# EAGLE design MiniAmp-01 (EAGLE 4.15)
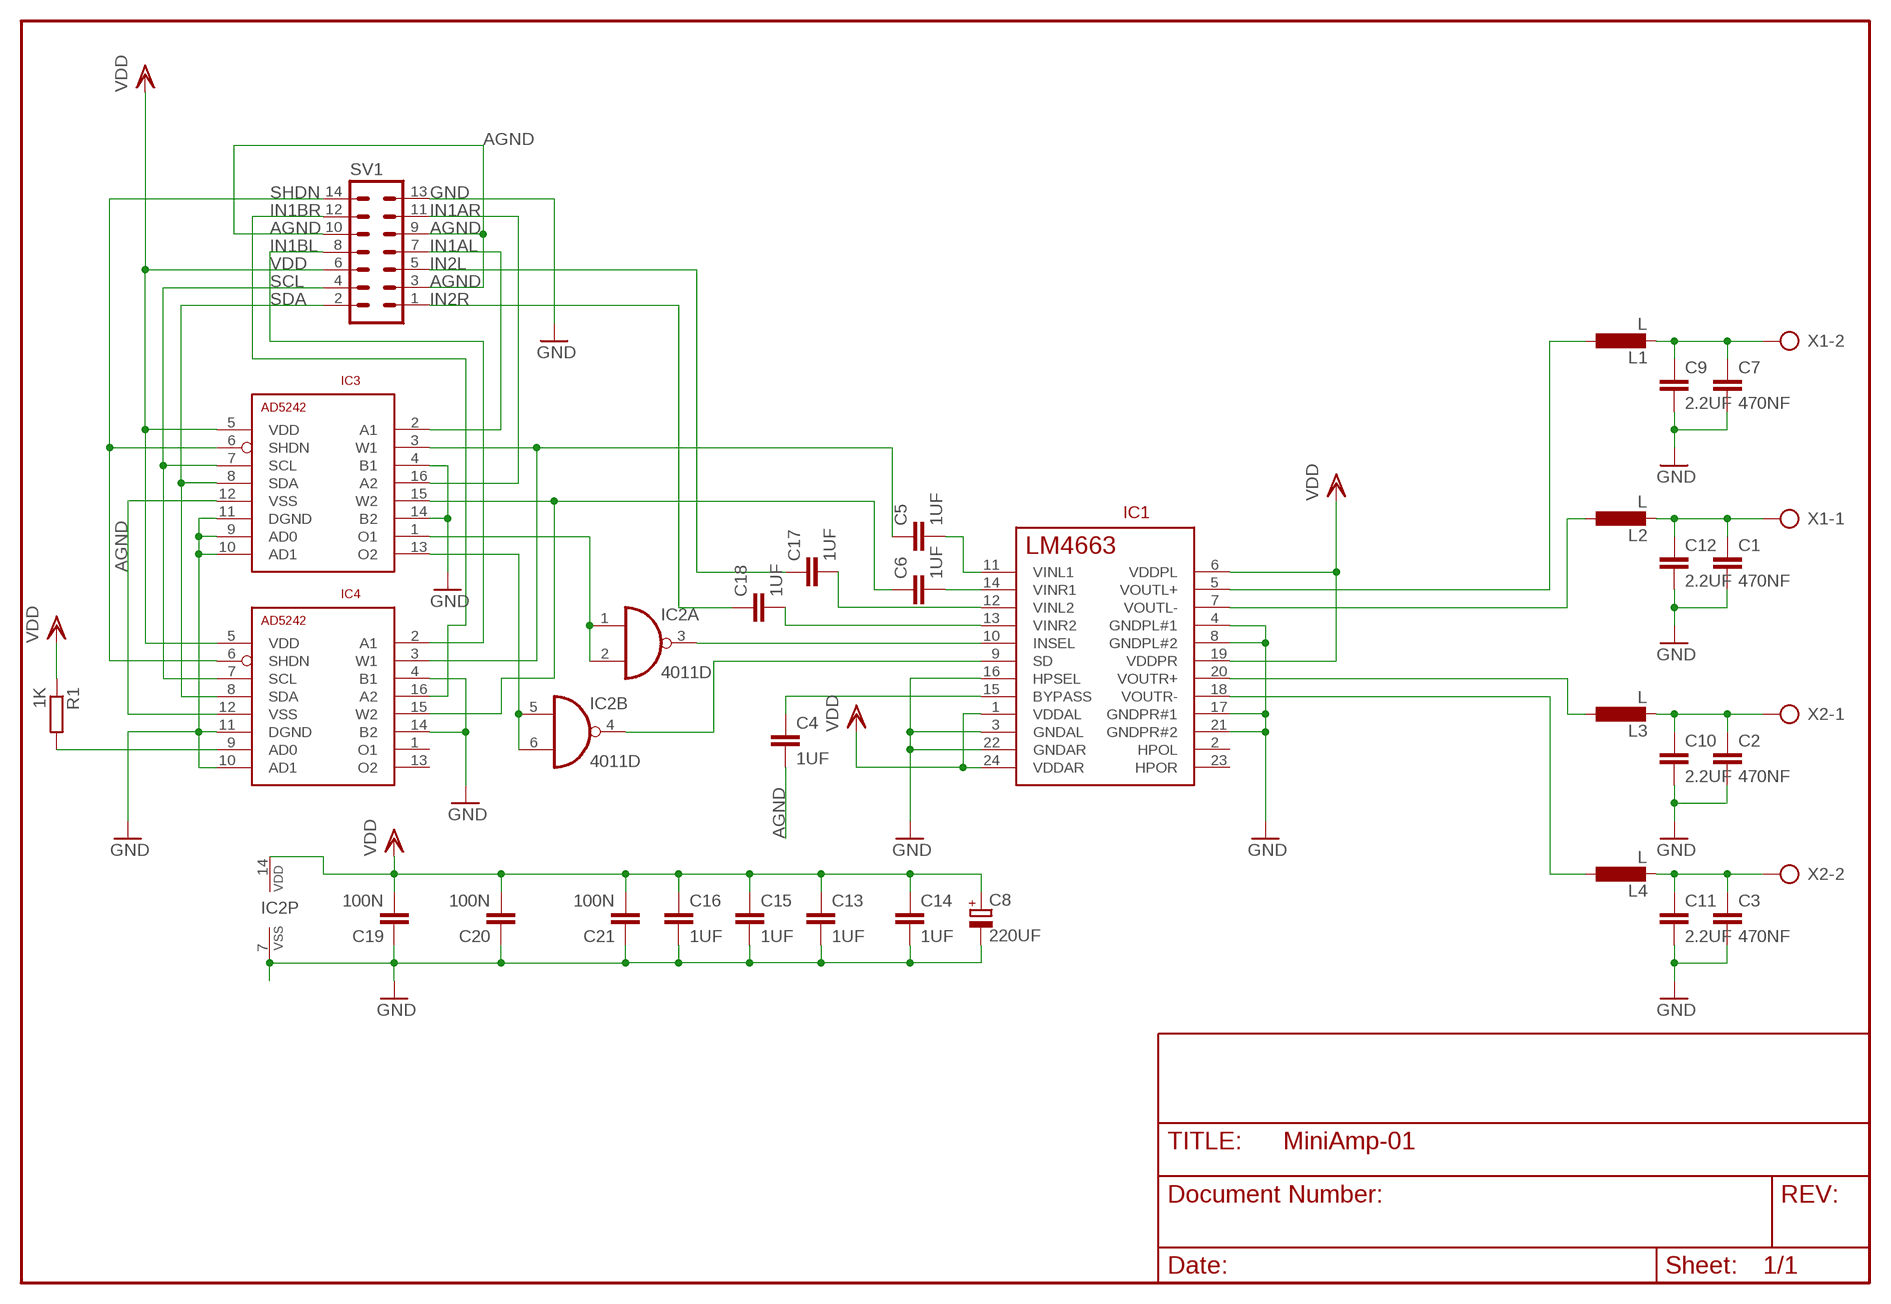
[diagram p0: schematic, sheet 1]

## Parts
C1  470NF  C-EUC1206  [C1206]
C2  470NF  C-EUC1206  [C1206]
C3  470NF  C-EUC1206  [C1206]
C4  1UF  C-EUC0805  [C0805]
C5  1UF  C-EUC0805  [C0805]
C6  1UF  C-EUC0805  [C0805]
C7  470NF  C-EUC1206  [C1206]
C8  220UF  CPOL-EUCT7343  [CT7343]
C9  2.2UF  C-EUC1812  [C1812]
C10  2.2UF  C-EUC1812  [C1812]
C11  2.2UF  C-EUC1812  [C1812]
C12  2.2UF  C-EUC1812  [C1812]
C13  1UF  C-EUC0805  [C0805]
C14  1UF  C-EUC0805  [C0805]
C15  1UF  C-EUC0805  [C0805]
C16  1UF  C-EUC0805  [C0805]
C17  1UF  C-EUC0805  [C0805]
C18  1UF  C-EUC0805  [C0805]
C19  100N  C-EUC0805  [C0805]
C20  100N  C-EUC0805  [C0805]
C21  100N  C-EUC0805  [C0805]
IC1  LM4663  [TSSOP24]
IC2  4011D  [SO14]
IC3  AD5242  [SO16]
IC4  AD5242  [SO16]
L1  L  [POWERINDUCTOR1]
L2  L  [POWERINDUCTOR1]
L3  L  [POWERINDUCTOR1]
L4  L  [POWERINDUCTOR1]
R1  1K  R-EU_R0805  [R0805]
SV1  MA07-2  [MA07-2]
X1  AK500/2  [AK500/2]
X2  AK500/2  [AK500/2]

## Nets
AGND: C4.2 IC3.12(VSS) IC4.12(VSS) SV1.3 SV1.9 SV1.10
GND: C1.2 C2.2 C3.2 C7.2 C8.- C9.2 C10.2 C11.2 C12.2 C13.2 C14.2 C15.2 C16.2 C19.1 C20.1 C21.1 IC1.3(GNDAL) IC1.4(GNDPL#1) IC1.8(GNDPL#2) IC1.16(HPSEL) IC1.17(GNDPR#1) IC1.21(GNDPR#2) IC1.22(GNDAR) IC2.7(P:VSS) IC3.4(B1) IC3.9(AD0) IC3.10(AD1) IC3.11(DGND) IC3.14(B2) IC4.4(B1) IC4.10(AD1) IC4.11(DGND) IC4.14(B2) SV1.13
IN1AL: IC3.2(A1) SV1.7
IN1AR: IC3.16(A2) SV1.11
IN1BL: IC4.2(A1) SV1.8
IN1BR: IC4.16(A2) SV1.12
IN2L: C17.1 SV1.5
IN2R: C18.1 SV1.1
L2 [power]: C1.1 C12.1 L2.P$2 X1.1
N$1 [power]: C7.1 C9.1 L1.P$2 X1.2
N$2: IC4.9(AD0) R1.2
N$3 [power]: C2.1 C10.1 L3.P$2 X2.1
N$4 [power]: C3.1 C11.1 L4.P$2 X2.2
N$5 [power]: IC1.5(VOUTL+) L1.P$1
N$6 [power]: IC1.7(VOUTL-) L2.P$1
N$7 [power]: IC1.20(VOUTR+) L3.P$1
N$8 [power]: IC1.18(VOUTR-) L4.P$1
N$9: IC2.1(A:I0) IC2.2(A:I1) IC3.1(O1)
N$10: IC2.5(B:I0) IC2.6(B:I1) IC3.13(O2)
N$11: IC1.10(INSEL) IC2.3(A:O)
N$12: IC1.9(SD) IC2.4(B:O)
N$13: C5.1 IC3.3(W1) IC4.3(W1)
N$14: C6.1 IC3.15(W2) IC4.15(W2)
N$19: C4.1 IC1.15(BYPASS)
N$23: C5.2 IC1.11(VINL1)
N$24: C6.2 IC1.14(VINR1)
N$27: C17.2 IC1.12(VINL2)
N$28: C18.2 IC1.13(VINR2)
SCL: IC3.7(SCL) IC4.7(SCL) SV1.4
SDA: IC3.8(SDA) IC4.8(SDA) SV1.2
SHDN: IC3.6(SHDN) IC4.6(SHDN) SV1.14
VDD: C8.+ C13.1 C14.1 C15.1 C16.1 C19.2 C20.2 C21.2 IC1.1(VDDAL) IC1.6(VDDPL) IC1.19(VDDPR) IC1.24(VDDAR) IC2.14(P:VDD) IC3.5(VDD) IC4.5(VDD) R1.1 SV1.6
Unconnected: IC1.2(HPOL) IC1.23(HPOR) IC2.8(C:I0) IC2.9(C:I1) IC2.10(C:O) IC2.11(D:O) IC2.12(D:I0) IC2.13(D:I1) IC4.1(O1) IC4.13(O2)

## Library data of the parts
C1-C7 C9-C21 = turbod3:C-EU: CAPACITOR, European symbol
C8 = rcl:CPOL-EU: POLARIZED CAPACITOR, European symbol
IC1 = turbod3:LM4663
IC2 = 40xx:4011: Quad 2-input NAND
IC3 IC4 = turbod3:AD5242
L1-L4 = turbod3:L
R1 = rcl:R-EU_: RESISTOR, European symbol
SV1 = con-lstb:MA07-2: PIN HEADER
X1 X2 = con-ptr500:AK500/2: CONNECTOR

## Net classes
1 power: width 2 mm

## Board
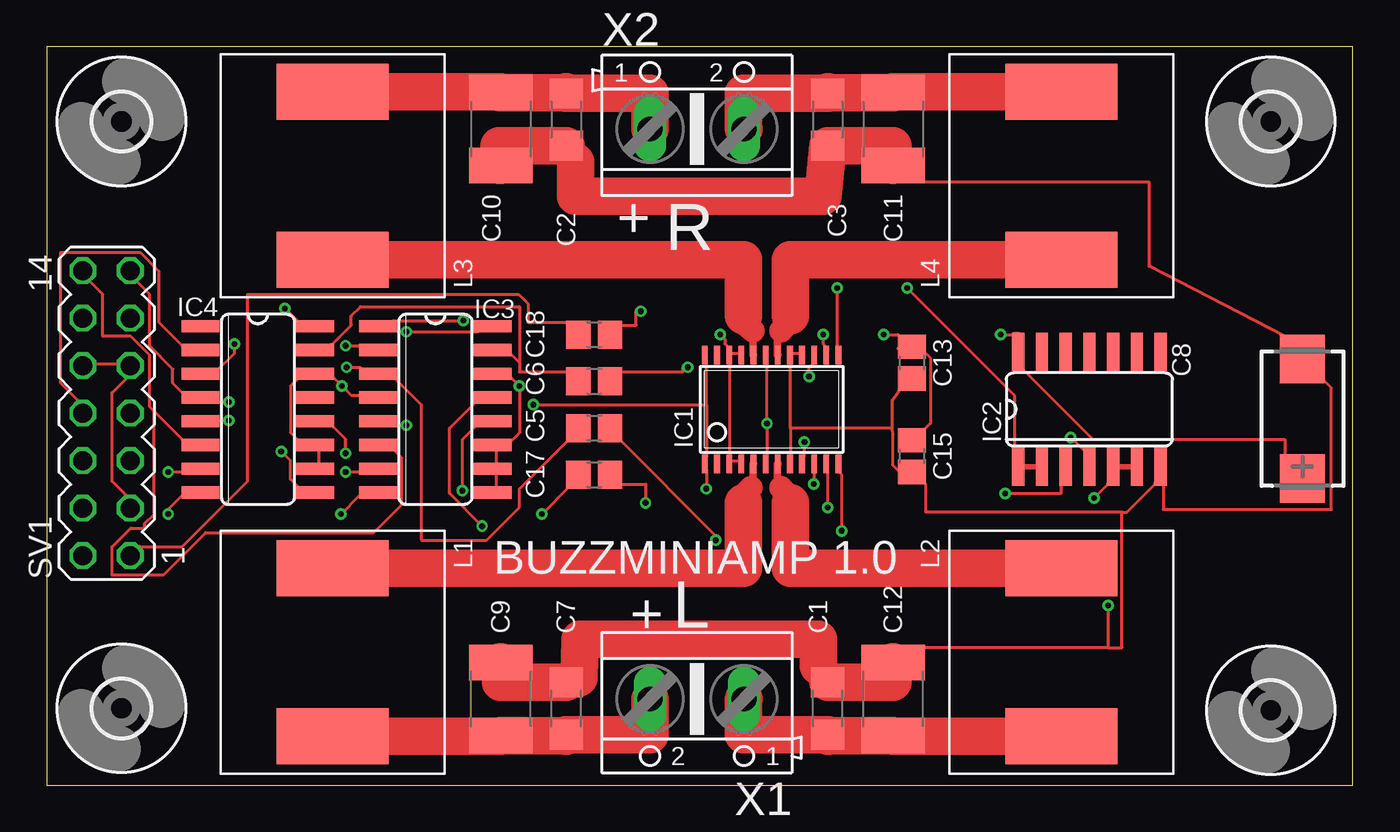
[diagram p1: board, top side]
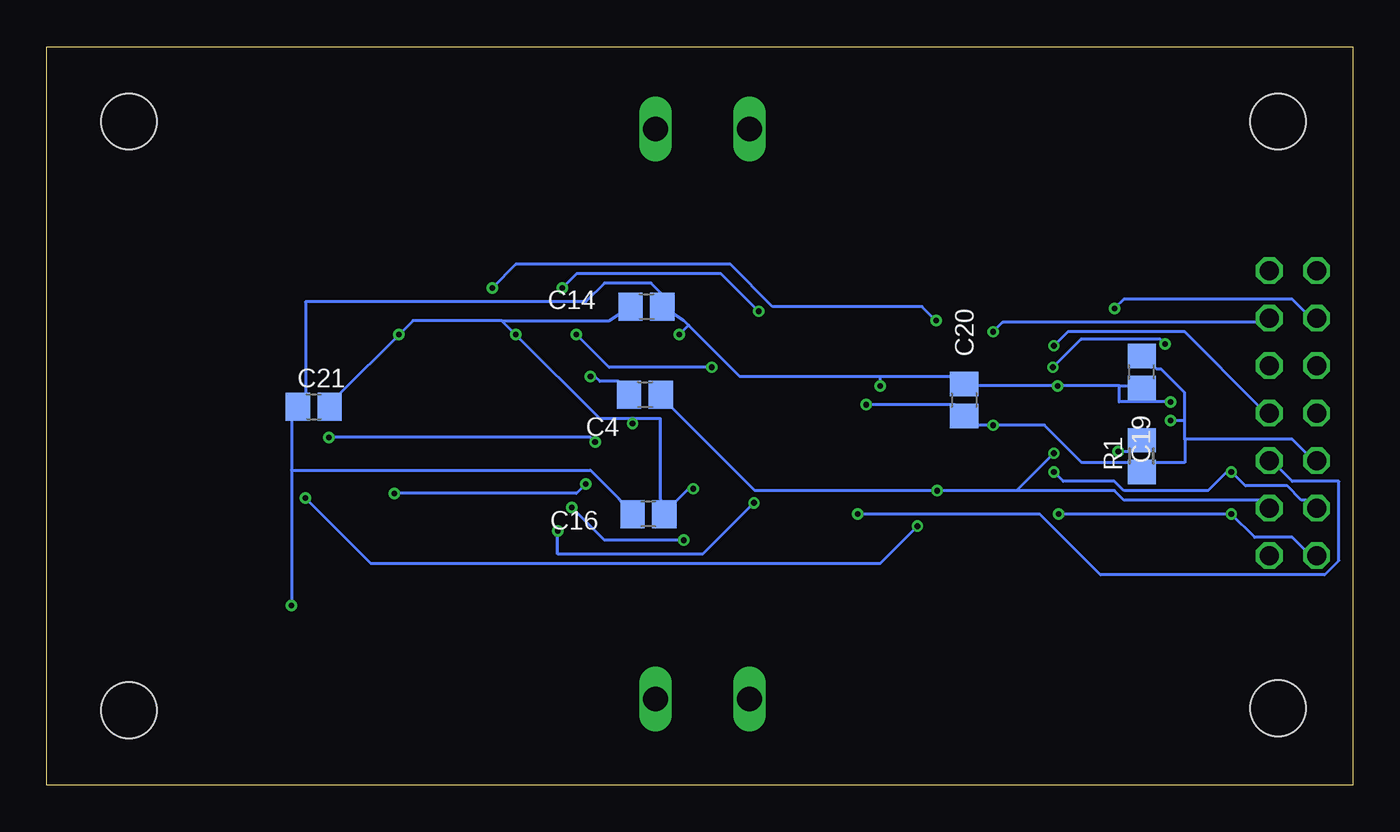
[diagram p2: board, bottom side, seen from below]

Size 69.9 x 39.5 mm. Coordinates in mm from the lower left corner, seen from the top.
Outline: 0,0 69.9,0 69.9,39.5 0,39.5 0,0
Copper layers (1*16): Top 0.018mm / dielectric 0.38mm / Bottom 0.018mm
Design rules "PCB-POOL": minimum track width 6mil, minimum drill 12mil, track to track 6mil, track to pad 6mil, pad to pad 6mil, via to via 6mil, smd to smd 6mil, copper to edge 20mil, drill to drill 8mil, minimum pad ring 8mil, minimum via ring 6mil, stop-mask expansion 3mil, vias tented up to drill 0mil, thermal gap 8mil

### Footprints (pad centres in the part's own frame; a part is rotated, then mirrored left to right if it is on the bottom)
C1206 = smd 1.6 x 1.8: 1 -1.4,0; 2 1.4,0
C0805 = smd 1.3 x 1.5: 1 -0.85,0; 2 0.85,0
CT7343 = smd 2.6 x 2.4: + 3.2,0; - -3.2,0
C1812 = smd 1.9 x 3.4: 1 -1.95,0; 2 1.95,0
TSSOP24 = smd 0.305 x 0.991: 1 -3.575,-2.918; 2 -2.925,-2.918; 3 -2.275,-2.918; 4 -1.625,-2.918; 5 -0.975,-2.918; 6 -0.325,-2.918; 7 0.325,-2.918; 8 0.975,-2.918; 9 1.625,-2.918; 10 2.275,-2.918; 11 2.925,-2.918; 12 3.575,-2.918; 13 3.575,2.918; 14 2.925,2.918; 15 2.275,2.918; 16 1.625,2.918; 17 0.975,2.918; 18 0.325,2.918; 19 -0.325,2.918; 20 -0.975,2.918; 21 -1.625,2.918; 22 -2.275,2.918; 23 -2.925,2.918; 24 -3.575,2.918
SO14 = smd 0.66 x 2.032: 1 -3.81,-3.073; 2 -2.54,-3.073; 3 -1.27,-3.073; 4 0,-3.073; 5 1.27,-3.073; 6 2.54,-3.073; 7 3.81,-3.073; 8 3.81,3.073; 9 2.54,3.073; 10 1.27,3.073; 11 0,3.073; 12 -1.27,3.073; 13 -2.54,3.073; 14 -3.81,3.073
SO16 = smd 0.66 x 2.032: 1 -4.445,-3.073; 2 -3.175,-3.073; 3 -1.905,-3.073; 4 -0.635,-3.073; 5 0.635,-3.073; 6 1.905,-3.073; 7 3.175,-3.073; 8 4.445,-3.073; 9 4.445,3.073; 10 3.175,3.073; 11 1.905,3.073; 12 0.635,3.073; 13 -0.635,3.073; 14 -1.905,3.073; 15 -3.175,3.073; 16 -4.445,3.073
POWERINDUCTOR1 = smd 3 x 6: P$1 -4.5,0; P$2 4.5,0
R0805 = smd 1.3 x 1.5: 1 -0.85,0; 2 0.85,0
MA07-2 = drill 1.016 octagon: 1 -7.62,-1.27; 2 -7.62,1.27; 3 -5.08,-1.27; 4 -5.08,1.27; 5 -2.54,-1.27; 6 -2.54,1.27; 7 0,-1.27; 8 0,1.27; 9 2.54,-1.27; 10 2.54,1.27; 11 5.08,-1.27; 12 5.08,1.27; 13 7.62,-1.27; 14 7.62,1.27
3,0 = hole 3: 0,0
AK500/2 = drill 1.321 long: 1 -2.515,0; 2 2.515,0

### Placement (x,y rotation side)
C1  41.8,4.1 90 top
C2  27.8,35.6 270 top
C3  41.8,35.6 270 top
C4  37.88,20.89 0 bottom
C5  29.3,19.1 0 top
C6  29.3,21.6 0 top
C7  27.8,4.1 90 top
C8  67.2,19.6 270 top
C9  24.3,4.6 90 top
C10  24.3,35.1 270 top
C11  45.3,35.1 270 top
C12  45.3,4.6 90 top
C13  46.3,22.6 270 top
C14  37.8,25.6 0 bottom
C15  46.3,17.6 270 top
C16  37.7,14.5 180 bottom
C17  29.3,16.6 0 top
C18  29.3,24.1 0 top
C19  11.3,22.1 90 bottom
C20  20.8,20.6 270 bottom
C21  55.61,20.24 0 bottom
IC1  38.8,20.1 0 top
IC2  55.8,20.1 0 top
IC3  20.8,20.1 270 top
IC4  11.3,20.1 270 top
L1  15.3,7.1 270 top
L2  54.3,7.1 270 top
L3  15.3,32.6 90 top
L4  54.3,32.6 90 top
R1  11.3,17.6 90 bottom
SV1  3.2,19.9 90 top
U$1  [3,0]  4,4.1 0 top
U$2  [3,0]  4,35.5 0 top
U$3  [3,0]  65.5,35.5 0 top
U$4  [3,0]  65.5,4 0 top
X1  34.8,4.6 180 top
X2  34.8,35.1 0 top

### Tracks (layer width: path | path; a pad name or v marks a point on that pad's centre or on a via)
AGND  (via drill 0.3)
  Top 0.152: SV1.10 2.5,22.5 4,22.5 SV1.9 4.25,21.75 3.5,21 3.5,16.25 4.25,15.5 SV1.3 | v16,17.75 16,18.5 15.25,19.25 IC4.12 | v22.25,15.75 22.25,18.5 23,19.25 IC3.12
  Bottom 0.152: 18,15.75 12.75,15.75 12.25,15.25 5,15.25 SV1.3 | 18,15.75 v22.25,15.75 32,15.75 36.5,20.25 C4.2 | 18,15.75 v16,17.75
GND  (via drill 0.3)
  Top 0.152: IC4.10 14.55,17.1 14.55,18.1 IC4.11 13.55,18.35 13.05,18.85 13.05,21.35 13.55,21.85 IC4.14 15.3,21.85 v15.8,21.35 16.3,20.85 16.8,20.85 IC3.4 | IC3.9 24.05,15.85 24.05,16.6 IC3.10 24.05,17.1 24.05,18.1 IC3.11 24.8,18.35 25.3,18.85 v25.3,21.35 24.8,21.85 IC3.14 | IC1.4 37.05,17.35 36.55,17.35 IC1.3 36.55,17.6 36.55,22.6 IC1.22 | IC1.22 36.55,23.1 37.05,23.1 IC1.21 | v36.05,24.1 36.3,23.85 36.3,23.6 36.55,23.35 IC1.22 | 37.6,31.5 38.3,32.25 38.05,31.5 | 28.3,33.35 C2.2 | 28.5,5.75 28.5,6.1 28.55,6.1 C7.2 | C1.2 41.3,6.35 | 39.8,19.1 39.8,22.6 IC1.17 39.8,23.1 40.3,23.1 IC1.16 | 39.8,19.1 39.8,17.6 IC1.8 | 57.55,14.6 47.05,14.6 47.05,16.1 46.8,16.35 C15.2 45.55,16.85 45.3,17.1 45.3,18.75 45.25,19.1 | 57.55,14.6 57.8,14.6 59.3,16.1 IC2.7 59.75,16.25 59.75,14.75 68.75,14.75 68.75,21.25 C8.- 66.25,24 59,27.75 59,32.25 46.75,32.25 C11.2 | 45.25,19.1 39.8,19.1 | 56.8,7.35 46.8,7.35 C12.2 | 56.8,7.35 57.55,7.35 57.55,14.6 | 45.25,19.1 45.25,20.6 45.8,21.35 C13.2 | v56.8,9.6 56.8,7.35 | v9.75,20.5 9,20.5 IC4.4 7.25,21 6.75,21.5 6.75,22.25 5.5,23.5 5.5,26.25 4.75,27 SV1.13
  Top 2: 24.3,6.6 C9.2 24.3,5.5 C7.2 | 45.3,6.6 C12.2 45.3,5.5 C1.2 | C10.2 24.2,33.15 24.2,34.2 C2.2 | C11.2 45.3,34.2 C3.2 41.55,31.5 38.05,31.5 37.6,31.5 28.3,31.5 28.3,33.35 | 28.5,5.75 28.55,7.8 41.3,7.8 41.3,6.35
  Bottom 0.152: C16.2 39.3,15.35 40.8,16.85 56.8,16.85 | 12.5,21.35 v15.8,21.35 20.3,21.35 C20.1 21.3,21.85 25.3,21.85 | 12.5,21.35 11.8,21.35 C19.1 | 35.55,24.6 32.8,21.85 25.3,21.85 | 35.55,24.6 35.8,24.85 C14.2 37.05,26.35 37.55,26.85 40.05,26.85 41.05,25.85 56.05,25.85 56.05,20.85 C21.1 56.8,19.6 56.8,16.85 | 35.55,24.6 v36.05,24.1 | 25.3,21.85 v25.3,21.35 | 56.8,16.85 v56.8,9.6 | v9.75,20.5 12.5,20.5 12.5,21.35
IN1AL  (via drill 0.3)
  Top 0.152: v16,23.5 16.75,23.5 IC3.2
  Bottom 0.152: v16,23.5 15.25,24.25 9,24.25 5,20.25 SV1.7
IN1AR  (via drill 0.3)
  Top 0.152: v19.25,24.25 23,24.25 IC3.16
  Bottom 0.152: v19.25,24.25 18.75,24.75 5,24.75 SV1.11
IN1BL
  Top 0.152: IC4.2 7.25,23.5 6,24.75 6,27.5 5,28.5 0.75,28.5 0.75,21.5 1.75,20.5 SV1.8
IN1BR  (via drill 0.3)
  Top 0.152: v12.75,25.5 13.5,24.75 IC4.16
  Bottom 0.152: v12.75,25.5 12.25,26 3.25,26 2.5,25.25 SV1.12
IN2L  (via drill 0.3)
  Top 0.152: v26.5,14.5 28,16 C17.1
  Bottom 0.152: v26.5,14.5 16.75,14.5 13.5,11.25 1.5,11.25 0.75,12 0.75,16.25 3.25,16.25 4,17 SV1.5
IN2R
  Top 0.152: C18.1 28,24.75 25.75,24.75 25.75,25.75 25.25,26.25 10.75,26.25 10.75,16.25 7.25,12.75 5,12.75 SV1.1
L2
  Top 2: L2.P$2 45.3,2.6 C12.1 41.8,2.65 | 41.8,2.65 C1.1 37.3,2.7 X1.1 | 41.8,2.65 41.8,2.6
N$1
  Top 2: L1.P$2 24.3,2.6 C9.1 27.8,2.65 | 27.8,2.65 C7.1 32.3,2.7 X1.2 | 27.8,2.65 27.8,2.6
N$2  (via drill 0.3)
  Top 0.152: v12.55,17.85 13.05,17.35 13.05,16.35 13.55,15.85 IC4.9
  Bottom 0.152: v12.55,17.85 11.8,17.85 R1.2
N$3
  Top 2: L3.P$2 24.3,37.1 C10.1 27.8,37.05 | 27.8,37.05 C2.1 32.3,37 X2.1 | 27.8,37.05 27.8,37.1
N$4
  Top 2: L4.P$2 45.3,37.1 C11.1 41.8,37.05 | 41.8,37.05 C3.1 37.3,37 X2.2 | 41.8,37.05 41.8,37.1
N$5
  Top 0.406: 37.7,15.9 37.7,16.2 37.8,16.3 37.8,17.2 IC1.5
  Top 1.27: 37.3,15.1 37.3,15.5 37.7,15.9
  Top 2: L1.P$1 37.3,11.6 37.3,15.1
N$6
  Top 0.406: 39.3,15.9 39.3,16 39.1,16.2 39.1,17.2 IC1.7
  Top 1.27: 39.8,15.1 39.8,15.4 39.3,15.9
  Top 2: L2.P$1 39.8,11.6 39.8,15.1
N$7
  Top 0.406: IC1.20 37.8,23 37.8,24.3
  Top 1.27: 37.3,25.1 37.3,24.7 37.8,24.3
  Top 2: L3.P$1 37.3,28.1 37.3,25.1
N$8
  Top 0.406: 39.3,24.3 39.1,24.3 39.1,23 IC1.18
  Top 1.27: 39.8,25.1 39.8,24.8 39.3,24.3
  Top 2: L4.P$1 39.8,28.1 39.8,25.1
N$9  (via drill 0.3)
  Top 0.152: v22.3,24.85 18.55,24.85 IC3.1 | v46.05,26.6 51.8,20.85 51.8,17.85 IC2.1
  Top 0.305: IC2.1 51.99,17.01 52,17 52.03,17.03 IC2.2
  Bottom 0.152: v22.3,24.85 23.05,25.6 31.05,25.6 33.3,27.85 44.8,27.85 v46.05,26.6
N$10  (via drill 0.3)
  Top 0.152: v23.3,13.85 21.55,15.6 21.55,19.1 23.05,20.6 IC3.13 | v56.05,15.35 56.8,16.1 IC2.5
  Top 0.305: IC2.6 IC2.5 57.03,17.03 57,17
  Bottom 0.152: v23.3,13.85 25.3,11.85 52.55,11.85 v56.05,15.35
N$11  (via drill 0.3)
  Top 0.152: v41.05,16.1 41.05,16.85 IC1.10 | v51.3,15.6 54.3,15.6 54.3,16.1 IC2.3
  Bottom 0.152: v41.05,16.1 41.55,15.6 v51.3,15.6
N$12  (via drill 0.3)
  Top 0.152: v40.55,18.35 40.55,17.6 IC1.9 | v54.8,18.6 55.55,17.85 IC2.4
  Top 0.305: IC2.4 55.8,17.3
  Bottom 0.152: v40.55,18.35 40.8,18.6 v54.8,18.6
N$13  (via drill 0.3)
  Top 0.152: v10.05,23.6 10.05,23.1 9.05,22.1 IC4.3 | v16.05,22.35 16.8,22.35 16.8,22.1 IC3.3 18.55,21.85 20.05,20.35 20.05,13.1 23.55,13.1 25.3,14.85 25.3,15.85 28.05,18.6 C5.1
  Bottom 0.152: v10.05,23.6 10.3,23.85 14.55,23.85 v16.05,22.35
N$14
  Top 0.152: 25.3,22.6 24.8,23.1 IC3.15 | 25.3,22.6 25.3,25.6 16.8,25.6 16.3,25.1 16.3,24.6 15.3,23.6 IC4.15 | 25.3,22.6 25.3,22.1 28.05,22.1 C6.1
N$19  (via drill 0.3)
  Top 0.152: v40.8,21.85 40.8,22.35 41.05,22.6 IC1.15
  Bottom 0.152: v40.8,21.85 40.55,21.85 40.3,21.6 39.3,21.6 C4.1
N$23  (via drill 0.3)
  Top 0.152: v41.8,14.85 41.8,16.85 IC1.11 | C5.2 30.55,18.6 35.8,13.35 v35.8,13.1
  Bottom 0.152: v41.8,14.85 40.05,13.1 v35.8,13.1
N$24  (via drill 0.3)
  Top 0.152: v41.55,24.1 41.55,23.6 41.8,23.35 IC1.14 | C6.2 30.55,22.1 34.05,22.1 34.05,22.35 v34.3,22.35
  Bottom 0.152: v41.55,24.1 39.8,22.35 v34.3,22.35
N$27  (via drill 0.3)
  Top 0.152: v42.55,13.6 42.55,16.6 42.3,16.85 IC1.12 | C17.2 30.55,16.1 32.05,16.1 v32.05,15.1
  Bottom 0.152: v42.55,13.6 42.55,12.35 34.8,12.35 v32.05,15.1
N$28  (via drill 0.3)
  Top 0.152: v42.3,26.6 42.3,23.35 IC1.13 | C18.2 30.55,24.6 31.55,24.6 31.55,25.35 v31.8,25.35
  Bottom 0.152: v42.3,26.6 41.55,27.35 33.8,27.35 v31.8,25.35
SCL  (via drill 0.3)
  Top 0.152: v6.5,16.75 7.25,16.75 IC4.7 | v16,16.75 16.75,16.75 IC3.7
  Bottom 0.152: SV1.4 2.5,15.25 2.75,15.25 3.5,16 5.75,16 v6.5,16.75 6.75,16.75 7.75,15.75 12.25,15.75 12.75,16.25 15.5,16.25 v16,16.75
SDA  (via drill 0.3)
  Top 0.152: v6.5,14.5 6.5,14.75 7.25,15.5 IC4.8 | v15.75,14.5 16.75,15.5 IC3.8
  Bottom 0.152: SV1.2 2.5,12.5 3.25,13.25 5.25,13.25 v6.5,14.5 v15.75,14.5
SHDN
  Top 0.152: 5.75,20 5.5,20.25 5.5,23 4.5,24 3,24 3,26.25 2.25,27 SV1.14 | 5.75,20 7.25,18.5 IC4.6 | 5.75,20 5.75,14.5 5.25,14 5.25,13.75 4.5,13.75 3.5,12.75 3.5,11.25 6.25,11.25 8.5,13.5 17.5,13.5 19,15 19,17.5 18.5,18 IC3.6
VDD  (via drill 0.3)
  Top 0.152: C13.1 45.55,23.35 | IC1.6 38.55,17.6 v38.55,19.35 38.55,22.6 IC1.19 | 35.3,20.35 35.3,22.6 IC1.24 | 35.3,20.35 35.3,17.6 IC1.1 35.3,16.85 v35.3,15.85 | v51.05,24.1 51.8,24.1 | C13.1 45.55,24.1 v44.8,24.1 | v26.05,20.35 35.3,20.35 | C15.1 46.8,18.85 47.3,19.35 47.3,22.85 46.8,23.35 C13.1 | IC2.14 52.25,22.25 56,18.5 66.25,18.5 66.25,17.5 C8.+ | v9.75,19.5 9,19.5 IC4.5 | v19.25,19.25 18.5,19.25 IC3.5
  Top 0.305: IC2.14 52,22.7 | IC2.14 | 51.8,24.1 52,24.1 IC2.14
  Bottom 0.152: 45.55,24.85 39.8,24.85 C14.1 | 45.55,24.85 50.3,24.85 v51.05,24.1 54.3,20.85 C21.2 | 38.55,19.6 40.3,19.6 v44.8,24.1 45.55,24.85 | 38.55,19.6 37.05,19.6 37.05,15.35 C16.1 36.3,15.1 35.55,15.85 v35.3,15.85 | 38.55,19.6 v38.55,19.35 | 10.8,22.35 C19.2 10.75,22.5 10.5,22.25 10.25,22.25 9,21 9,19.5 | v26.05,20.35 21.3,20.35 C20.2 20.25,19.25 v19.25,19.25 16.5,19.25 14.5,17.25 12,17.25 R1.1 10.75,17.25 9,17.25 9,18.5 | 9,18.5 9,19.5 | 9,19.5 v9.75,19.5 | 9,18.5 3.25,18.5 2.5,17.75 SV1.6

### Text on the board
tPlace: + | R | + | L
tNames: BUZZMINIAMP 1.0